# Altium schematic sheet Cell_Balancing.SchDoc
size A4; SheetNumber: 5; SheetTotal: 5
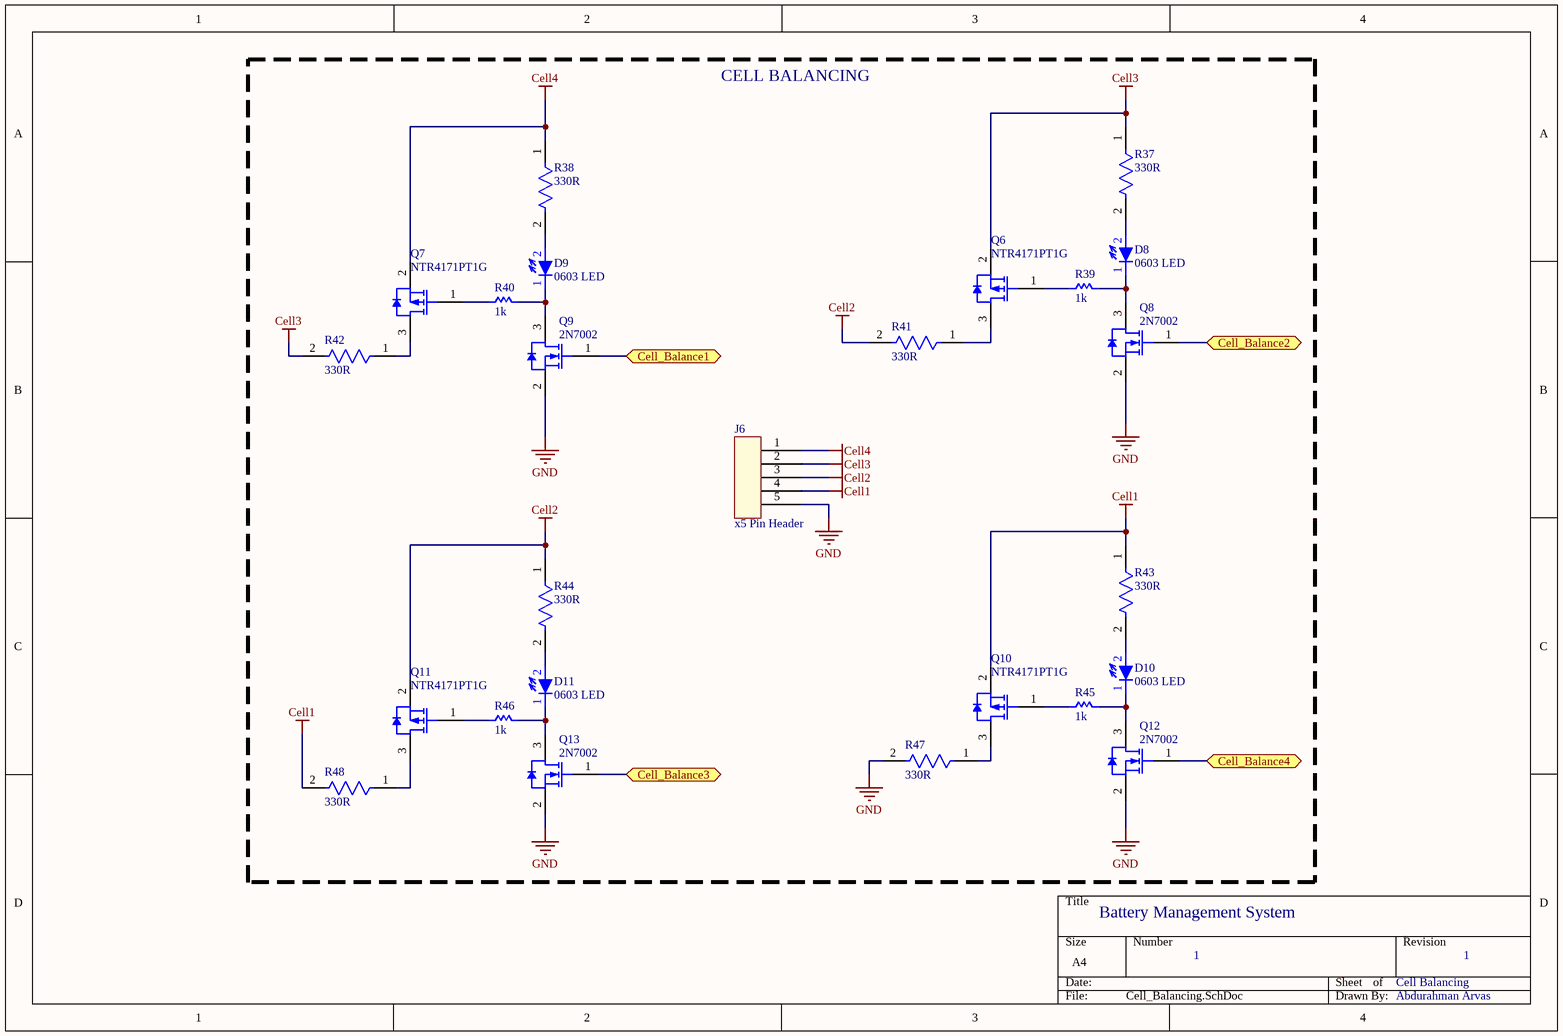
[diagram p0: Cell_Balancing.SchDoc]

## Parts
D8  0603 LED  [LED_0603]
D9  0603 LED  [LED_0603]
D10  0603 LED  [LED_0603]
D11  0603 LED  [LED_0603]
J6  x5 Pin Header  [CONN X5]
Q6  NTR4171PT1G  [ONSC-SOT-23-3-318-08_V]
Q7  NTR4171PT1G  [ONSC-SOT-23-3-318-08_V]
Q8  2N7002  [STM-SOT-23-3_V]
Q9  2N7002  [STM-SOT-23-3_V]
Q10  NTR4171PT1G  [ONSC-SOT-23-3-318-08_V]
Q11  NTR4171PT1G  [ONSC-SOT-23-3-318-08_V]
Q12  2N7002  [STM-SOT-23-3_V]
Q13  2N7002  [STM-SOT-23-3_V]
R37  330R  [FP-CRCW2512-e3-IPC_B]
R38  330R  [FP-CRCW2512-e3-IPC_B]
R39  1k  [R0805]
R40  1k  [R0805]
R41  330R  [FP-CRCW2512-e3-IPC_B]
R42  330R  [FP-CRCW2512-e3-IPC_B]
R43  330R  [FP-CRCW2512-e3-IPC_B]
R44  330R  [FP-CRCW2512-e3-IPC_B]
R45  1k  [R0805]
R46  1k  [R0805]
R47  330R  [FP-CRCW2512-e3-IPC_B]
R48  330R  [FP-CRCW2512-e3-IPC_B]

## Blocks framed on the sheet
CELL BALANCING: D8-D11 J6 Q6-Q13 R37-R48

## Ports
Cell_Balance1 (bidir), Cell_Balance2 (bidir), Cell_Balance3 (bidir), Cell_Balance4 (bidir)

## Nets
Cell1: J6.4 Q10.2(S) R43.1 R48.2
Cell2: J6.3 Q11.2(S) R41.2 R44.1
Cell3: J6.2 Q6.2(S) R37.1 R42.2
Cell4: J6.1 Q7.2(S) R38.1
GND: J6.5 Q8.2(S) Q9.2(S) Q12.2(S) Q13.2(S) R47.2
Cell_Balance1: Q9.1(G) ; port Cell_Balance1
Cell_Balance2: Q8.1(G) ; port Cell_Balance2
Cell_Balance3: Q13.1(G) ; port Cell_Balance3
Cell_Balance4: Q12.1(G) ; port Cell_Balance4
NetD8_1: D8.1(Cathode) Q8.3(D) R39.2
NetD8_2: D8.2(Anode) R37.2
NetD9_1: D9.1(Cathode) Q9.3(D) R40.2
NetD9_2: D9.2(Anode) R38.2
NetD10_1: D10.1(Cathode) Q12.3(D) R45.2
NetD10_2: D10.2(Anode) R43.2
NetD11_1: D11.1(Cathode) Q13.3(D) R46.2
NetD11_2: D11.2(Anode) R44.2
NetQ6_1: Q6.1(G) R39.1
NetQ6_3: Q6.3(D) R41.1
NetQ7_1: Q7.1(G) R40.1
NetQ7_3: Q7.3(D) R42.1
NetQ10_1: Q10.1(G) R45.1
NetQ10_3: Q10.3(D) R47.1
NetQ11_1: Q11.1(G) R46.1
NetQ11_3: Q11.3(D) R48.1

## Notes on the sheet
- Battery Management System
- 1
- Cell Balancing
- Abdurahman Arvas

## Library data of the parts
D8-D11 = Led 0603: Light Emitting Diode with 0603 footprint.
J6 = CONN X5
Q6 Q7 Q10 Q11 = CMP-1058-00738-1: Power MOSFET, -30 V, 3.5 A, Single P-Channel, 3-Pin SOT-23, Pb-Free, Tape and Reel; Manufacturer: On Semiconductor; VGS Max (V): 12; V(BR)DSS Min (V): 30; Crss Typ (pF): 65; VGS(th) Max (V): 1.4; Ciss Typ (pF): 720; Qrr Typ (nC): 8; Coss Typ (pF): 95; Channel Polarity: P Channel; ComponentLink2URL: http://www.onsemi.cn/pub_link/Collateral/NTR4171P-D.PDF; ComponentLink1Description: Manufacturer URL; PartNumber: NTR4171PT1G; Mounting Technology: Surface Mount; ComponentLink1URL: http://www.onsemi.com/; Packing: Tape and Reel; Package Type: SOT-23-3; ComponentLink2Description: Datasheet; PackageReference: SOT-23-3-318-08; Configuration: Single; ComponentLink3Description: Package Specification; DatasheetVersion: Rev. 1; PackageVersion: Rev. AP, 11/2009; RoHS: Pb-Free; PackageDescription: 3-Pin Small Outline Transistor, Body 2.92 x 1.3 mm, Pitch 0.95 mm; ComponentLink3URL: http://www.onsemi.cn/pub_link/Collateral/318-08.PDF
Q8 Q9 Q12 Q13 = CMP-0434-00001-1: N-channel 60 V, 1.8 Ohm, 0.35 A STripFET(TM) II Power MOSFET, SOT23; Manufacturer: STMicroelectronics; PartNumber: 2N7002; ComponentLink2Description: Datasheet; ComponentLink2URL: http://www.st.com/st-web-ui/static/active/en/resource/technical/document/datasheet/CD00005134.pdf; ComponentLink1Description: Manufacturer URL; ComponentLink1URL: http://www.st.com/; DatasheetVersion: Rev. 9, 11/2008; PackageReference: SOT-23; Mounting Technology: Surface Mount; PackageDescription: 3-Pin SOT23, 3.016 x 2.8 mm Body, 0.95 mm Pitch
R37 R38 R41-R44 R47 R48 = CMP-1018-00062-2: RES Thick Film, 330Ω, 5%, 1W, 200ppm/°C, 2512; Voltage Rating: 500V; Height: 0.6mm; Radiation Hardening: No; Resistance: 330R; Termination: Solder; Power Rating: 1W; Packaging: Tape and Reel; Max Operating Temperature: 155°C; Case Code (Imperial): 2512; Max Power Dissipation: 1W; Case Code (Metric): 6432; Case/Package: 2512; Width: 0.124inch; Temperature Coefficient: 200ppm/°C; Number of Terminations: 2; Length: 6.3mm; Contact Plating: Tin; Min Operating Temperature: -55°C; Military Standard: Not; Tolerance: 5%; Package Quantity: 1; Voltage Rating (DC): 500V; Composition: Thick Film; Lead Free: Lead Free; Depth: 3.15mm; Mount: Surface Mount; Weight: 0.001429oz; Number of Pins: 2; Features: Automotive AEC-Q200
R39 R40 R45 R46 = SMD Resistor: SMD Chip Resistor